# Altium schematic sheet sch_expansion.SchDoc
size A; SheetNumber: 3; SheetTotal: 3
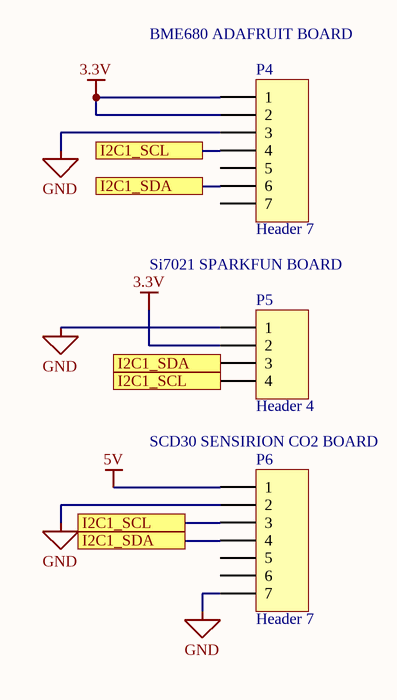
[diagram p0: sch_expansion.SchDoc]

## Parts
P4  Header 7  [HDR1X7]
P5  Header 4  [HDR1X4]
P6  Header 7  [HDR1X7]

## Ports
I2C1_SCL, I2C1_SDA

## Nets
3.3V: P4.1 P4.2 P5.2
5V: P6.1
GND: P4.3 P5.1 P6.2 P6.7
I2C1_SCL: P4.4 P5.4 P6.3 ; port I2C1_SCL
I2C1_SDA: P4.6 P5.3 P6.4 ; port I2C1_SDA

Not connected (* = marked no-connect by the designer): P4 5 7; P6 5 6

## Notes on the sheet
- (near P4) BME680 ADAFRUIT BOARD
- Si7021 SPARKFUN BOARD
- SCD30 SENSIRION CO2 BOARD

## Library data of the parts
P4 P6 = Header 7: Header, 7-Pin; LatestRevisionDate: 17-Jul-2002; LatestRevisionNote: Re-released for DXP Platform.; Publisher: Altium Limited
P5 = Header 4: Header, 4-Pin; LatestRevisionDate: 17-Jul-2002; LatestRevisionNote: Re-released for DXP Platform.; Publisher: Altium Limited